# Altium schematic sheet COMM.SchDoc
size A; SheetNumber: 5; SheetTotal: 7
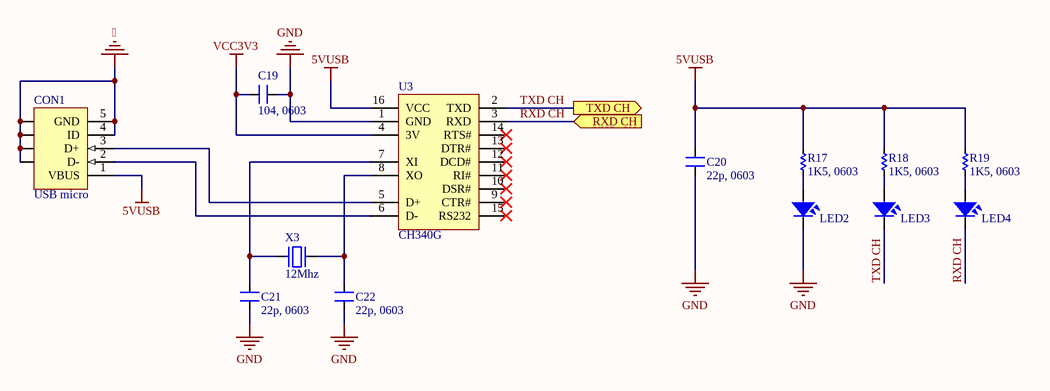
[diagram p0: COMM.SchDoc]

## Parts
C19  104, 0603  [SM-0603]
C20  22p, 0603  [SM-0603]
C21  22p, 0603  [SM-0603]
C22  22p, 0603  [SM-0603]
CON1  USB micro  [CONN/USB/MICRO/RA]
LED2  LED  [LED-0805-Blue]  (value not drawn)
LED3  LED  [LED-0805-Blue]  (value not drawn)
LED4  LED  [LED-0805-Blue]  (value not drawn)
R17  1K5, 0603  [RES-SMD-0603]
R18  1K5, 0603  [RES-SMD-0603]
R19  1K5, 0603  [RES-SMD-0603]
U3  CH340G  [SO16]
X3  12Mhz  [XT2]

## Ports
RXD CH (in), TXD CH (out)

## Nets
5VUSB: C20.2 CON1.1(VBUS) R17.1 R18.1 R19.1 U3.16(VCC)
: CON1.4(ID) CON1.5(GND) CON1.6(SHLD) CON1.7(SHLD) CON1.8(SHLD) CON1.9(SHLD)
GND: C19.1 C20.1 C21.1 C22.1 LED2.2 U3.1(GND)
VCC3V3: C19.2 U3.4(3V)
RXD CH: LED4.2 U3.3(RXD) ; port RXD CH
TXD CH: LED3.2 U3.2(TXD) ; port TXD CH
NetC21_2: C21.2 U3.7(XI) X3.1
NetC22_2: C22.2 U3.8(XO) X3.2
NetCON1_2: CON1.2(D-) U3.6(D-)
NetCON1_3: CON1.3(D+) U3.5(D+)
NetLED2_1: LED2.1 R17.2
NetLED3_1: LED3.1 R18.2
NetLED4_1: LED4.1 R19.2

Not connected (* = marked no-connect by the designer): U3 9(CTR#)* 10(DSR#)* 11(RI#)* 12(DCD#)* 13(DTR#)* 14(RTS#)* 15(RS232)*

## Library data of the parts
C19-C22 = CM: Cap SMD; Value: 103
CON1 = CON USB micro: USB micro, 5 pins
LED2-LED4 = LED SMD: Value: LED 3 - 5 ly 2 Colour
R17-R19 = Res-SMD: Resistor; Manufacturer: Generic Components; Class: Passive; Published: 08/06/2000; Publisher: Altium Hobart Technology Centre
U3 = CH340G: High and Low Side Driver; Note: Pins 4, 8 and 14 are not connected; Published: 8-Jun-2000; LatestRevisionDate: 04-Mar-2005; LatestRevisionNote: Stylized 3D Model Added.; DatasheetVersion: PD60147J; PackageReference: PDIP14; Publisher: Altium Limited; PackageDescription: DIP; 14 Leads; Row Spacing 7.62 mm; Pitch 2.54 mm; ComponentLink1Description: Manufacturer Link; ComponentLink1URL: http://www.irf.com/; ComponentLink2Description: Datasheet; ComponentLink2URL: http://www.irf.com/product-info/datasheets/data/ir2110.pdf
X3 = XT2: Crystal, 32.768 KHz, -40 to 85 degC, 3.2 x 1.5 x 0.9 mm SMD; Value: 4Mhz